# EasyEDA schematic schematic_diagram.json
TITLE: Schemat projektu inżynierskiego; REV: 1.0; Sheet: 1/1; Company: Bartosz Gałczyński
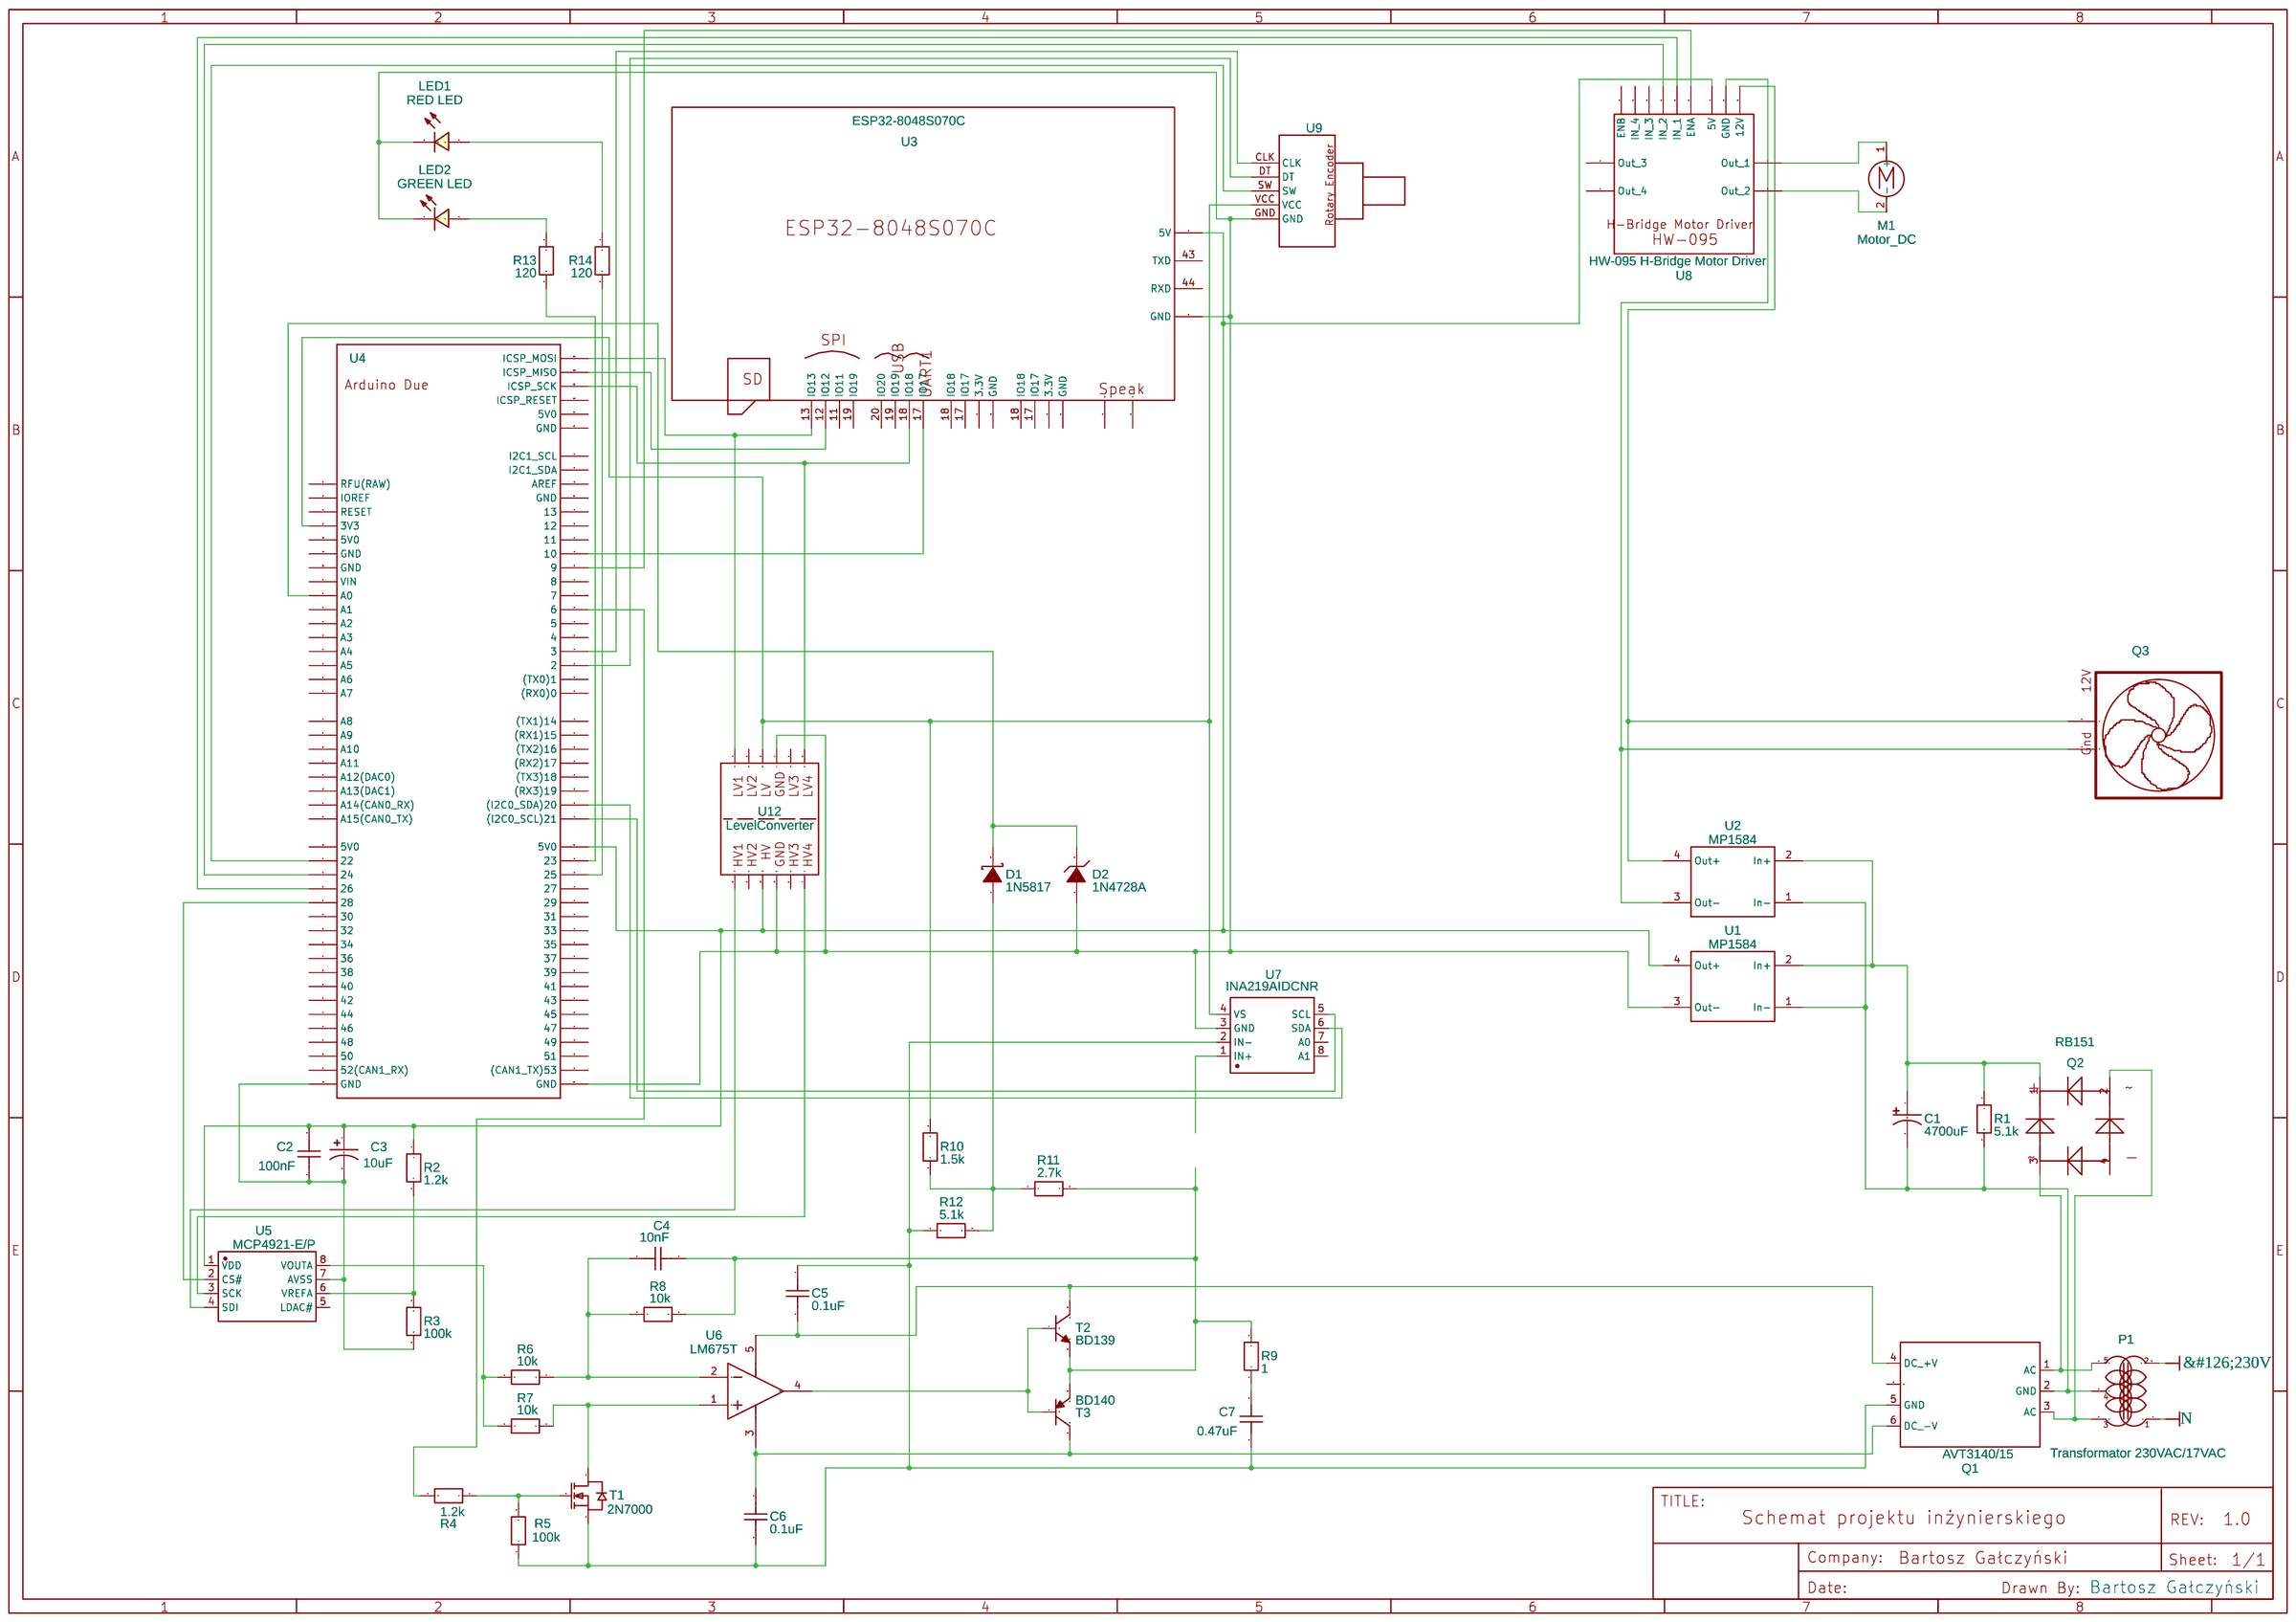
[diagram p0: schematic sheet]

## Parts
C1  4700uF  [CAP-TH_BD10.0-P5.00-D1.0-FD]
C2  100nF  [C0603]
C3  10uF  [CASE-A_3216]
C4  10nF  [C0603]
C5  0.1uF  [C0603]
C6  0.1uF  [C0603]
C7  0.47uF  [C0603]
D1  1N5817  [DO-41_BD2.4-L4.7-P8.70-D0.9-FD]
D2  1N4728A  [DO-41_BD2.4-L4.7-P8.70-D0.9-FD]
LED1  RED LED  [LED-TH_LED-3MM_RED]
LED2  GREEN LED  [LED0603-RD_BLUE]
M1  Motor_DC  [CONN-TH_2P-P5.08]
P1  Transformator 230VAC/17VAC  [TRANS_TOROIDE_40_20]
Q1  AVT3140/15  [POWERPAK-SO-8_L6.2-W5.2-P1.27-BL_POWERPAK]
Q2  RB151  [RB151 THRU RB157]
Q3  NO  [FAN]
R1  5.1k  [R0603]
R2  1.2k  [R0603]
R3  100k  [R0603]
R4  1.2k  [R0603]
R5  100k  [R0603]
R6  10k  [R0603]
R7  10k  [R0603]
R8  10k  [R0603]
R9  1  [R0603]
R10  1.5k  [R0603]
R11  2.7k  [R0603]
R12  5.1k  [R0603]
R13  120  [R0603]
R14  120  [R0603]
T1  2N7000  [TO-92-3_L4.9-W3.7-P1.27-R]
T2  BD139  [TO-126_L7.5-W2.5-P2.3-B]
T3  BD140  [TO-126_L7.5-W2.5-P2.3-B]
U1  MP1584  [MP1584]
U2  MP1584  [MP1584]
U3  ESP32-8048S070C
U4  PA_DUE_BRD  [PA_DUE]
U5  MCP4921-E/P  [PDIP-8_L9.3-W6.4-P2.54-LS7.6-BL]
U6  LM675T  [TO_P5-L10.2-W4.6-P1.70-TR]
U7  INA219AIDCNR  [SOT-23-8_L3.0-W1.7-P0.65-LS2.8-BR]
U8  HW-095 H-Bridge Motor Driver
U9  NO  [ROTARYENCODERF]
U12  LevelConverter  [LEVELCONVERTER_4]

## Library data of the parts
C1 = 50ZLH220MEFC10X16: Contributor: LCSC; Supplier: LCSC; Supplier Part: C424109; Manufacturer: rubycon(红宝石); JLCPCB Part Class: Extended Part; link: https://lcsc.com/eda_search?q=C424109&%26type=1&ref=editor
C2 C4-C7 = C_0603_US: Contributor: LCEDA_Lib
C3 = C_Tan_SMD_A_US: Contributor: LCEDA_Lib
D1 = 1N5817: Supplier: LCSC; Manufacturer: MDD(辰达半导体); Supplier Part: C3062; JLCPCB Part Class: Extended Part; link: https://lcsc.com/eda_search?q=C3062&%26type=1&ref=editor
D2 = 1N4733A: Supplier: LCSC; Manufacturer: TC(德昌); Supplier Part: C112411; JLCPCB Part Class: Extended Part; link: https://lcsc.com/eda_search?q=C112411&%26type=1&ref=editor
LED1 = LED: Supplier: LCSC; Supplier Part: C9900009041; Manufacturer: null; Manufacturer Part: LED05-红灯; Contributor: LCSC; JLCPCB Part Class: Extended Part
LED2 = GREENLED-0603: Contributor: multibytetech; Manufacturer Part: BLUEled-0603; JLCPCB Part Class: Extended Part; Manufacturer: null
M1 = Motor_DC: Contributor: KiCAD; license: https://www.gnu.org/licenses/lgpl-2.1.html
P1 = TRANS_TOROIDE_40_20: Manufacturer Part: Transformers; Contributor: Laercio Oliveira; Supplier: TMZ
Q1 = POWER SUPPLY: Supplier: LCSC; Manufacturer: VISHAY(威世); Manufacturer Part: SI7949DP-T1-GE3; Contributor: michellelema; Supplier Part: C145350; JLCPCB Part Class: Extended Part; Package Display: No
Q2 = SILICON BRIDGE RECTIFIER: link: https://www.mouser.com/ds/2/345/rb151-157-29859.pdf; Contributor: deathstepdspw
Q3 = Fan12V: Contributor: victor390; sim: true
R1-R14 = R_0603_EU: Contributor: LCEDA_Lib
T1 = 2N7000: Supplier: LCSC; Manufacturer: CJ(江苏长电/长晶); Supplier Part: C9114; JLCPCB Part Class: Extended Part
T2 = BD139: Supplier: LCSC; Manufacturer: ST(意法半导体); Supplier Part: C27866; JLCPCB Part Class: Extended Part; link: https://lcsc.com/eda_search?q=C27866&%26type=1&ref=editor
T3 = BD140: Supplier: LCSC; Manufacturer: ST(意法半导体); Supplier Part: C38652; JLCPCB Part Class: Extended Part; link: https://lcsc.com/eda_search?q=C38652&%26type=1&ref=editor
U1 U2 = MP1584: Contributor: ksm_ma
U3 = ESP32-8048S070C: link: https://pl.aliexpress.com/w/wholesale-esp32-8048s070c.html?spm=a2g0o.detail.auto_suggest.2.50cdoOQSoOQSnG; Contributor: gartosz
U4 = PA_DUE_BRD: PatternAgents Due Shield Board Pattern; Contributor: PatternAgents
U5 = MCP4921-E/P: Contributor: lcsc; Supplier: LCSC; Supplier Part: C640392; Manufacturer: MICROCHIP(美国微芯); JLCPCB Part Class: Extended Part; link: https://lcsc.com/eda_search?q=C640392&%26type=1&ref=editor
U6 = LM675T: Contributor: LCSC; Supplier: LCSC; Supplier Part: C1346154; Manufacturer: TI(德州仪器); JLCPCB Part Class: Extended Part; link: https://lcsc.com/eda_search?q=C1346154&%26type=1&ref=editor
U7 = INA219AIDCNR: Supplier: LCSC; Manufacturer: TI(德州仪器); Contributor: LCSC; Supplier Part: C87469; JLCPCB Part Class: Extended Part
U8 = HW-095 H-Bridge Motor Driver: Manufacturer: Lafvin; Manufacturer Part: HW-095; Supplier Part: HW-095; link: https://components101.com/modules/l293n-motor-driver-module; Contributor: ExcaliburStem
U9 = ROTARYENCODER: Contributor: JLHAC
U12 = LevelConverter_4: Contributor: fsergiy

## Nets
&#126;230V: P1.2
N: P1.1
Net-(C1-1): C1.1 Q2.1 R1.1 U1.2(In+) U2.2(In+)
Net-(C1-2): C1.2 P1.4 Q1.2(GND) R1.2 U1.1(In-) U2.1(In-)
Net-(C2-1): C2.1 C3.2 R3.2 U4.GND@2(GND) U5.7(AVSS)
Net-(C2-2): C2.2 C3.1 R2.1 U1.4(Out+) U3.5V U4.5V0@1(5V0) U5.1(VDD) U8.7(5V) U12.10
Net-(C4-1): C4.1 R6.1 R8.2 U6.2(-IN)
Net-(C4-2): C4.2 R8.1 R9.1 R11.2 T2.3(E) T3.3(E)
Net-(C5-1): C5.1 C6.2 C7.1 Q1.5(GND) R5.1 R12.1 T1.1(S) U7.2(IN-)
Net-(C5-2): C5.2 Q1.4(DC +V) T2.2(C) U6.5(VCC)
Net-(C6-1): C6.1 Q1.6(DC -V) T3.2(C) U6.3(VEE)
Net-(C7-2): C7.2 R9.2
Net-(D1-1): D1.1(A) R10.2 R11.1 R12.2
Net-(D1-2): D1.2(K) D2.2(K) U4.A0
Net-(D2-1): D2.1(A) LED1.2 LED2.1(K) U1.3(Out-) U3.GND U4.GND@3(GND) U7.3(GND) U9.GND U12.4 U12.9
Net-(LED1-1): LED1.1 R14.1
Net-(LED2-2): LED2.2(A) R13.2
Net-(M1-1): M1.1(+) U8.1(Out 1)
Net-(M1-2): M1.2(-) U8.2(Out 2)
Net-(P1-3): P1.3 Q1.3(AC) Q2.2
Net-(P1-5): P1.5 Q1.1(AC) Q2.3
Net-(Q3-1): Q3.1 U2.4(Out+) U8.5(12V)
Net-(Q3-2): Q3.2 U2.3(Out-) U8.6(GND)
Net-(R2-2): R2.2 R3.1 U5.6(VREFA)
Net-(R4-1): R4.1 R5.2 T1.2(G)
Net-(R4-2): R4.2 U4.6
Net-(R6-2): R6.2 R7.2 U5.8(VOUTA)
Net-(R7-1): R7.1 T1.3(D) U6.1(+IN)
Net-(R10-1): R10.1 U4.3V3 U7.4(VS) U9.VCC U12.3
Net-(R13-1): R13.1 U4.23
Net-(R14-2): R14.2 U4.25
Net-(T2-1): T2.1(B) T3.1(B) U6.4(OUT)
Net-(U3-12): U3.12(IO12) U4.ICSP_MISO
Net-(U3-13): U3.13(IO13) U4.ICSP_MOSI U12.1
Net-(U3-17): U3.17(IO17) U4.10
Net-(U3-18): U3.18(IO18) U4.ICSP_SCK U12.6
Net-(U4-2): U4.2 U9.DT
Net-(U4-3): U4.3 U9.CLK
Net-(U4-9): U4.9 U8.8(ENA)
Net-(U4-20): U4.20((I2C0_SDA)20) U7.6(SDA)
Net-(U4-21): U4.21((I2C0_SCL)21) U7.5(SCL)
Net-(U4-22): U4.22 U9.SW
Net-(U4-24): U4.24 U8.10(IN 2)
Net-(U4-26): U4.26 U8.9(IN 1)
Net-(U4-28): U4.28 U5.2(CS#)
Net-(U5-3): U5.3(SCK) U12.7
Net-(U5-4): U5.4(SDI) U12.12

Not connected (* = marked no-connect by the designer): Q2 4; U3 3.3V 5(5V) 6(TXD) 11(IO11) 19(IO19) 20(IO20) 43(TXD) 44(RXD); U4 0((RX0)0) 1((TX0)1) 4 5 5V0@0(5V0) 5V0@2(5V0) 5V0@3(5V0) 7 8 11 12 13 14((TX1)14) 15((RX1)15) 16((TX2)16) 17((RX2)17) 18((TX3)18) 19((RX3)19) 27 29 30 31 32 33 34 35 36 37 38 39 40 41 42 43 44 45 46 47 48 49 50 51 52(52(CAN1_RX)) 53((CAN1_TX)53) A1 A2 A3 A4 A5 A6 A7 A8 A9 A10 A11 A12(A12(DAC0)) A13(A13(DAC1)) A14(A14(CAN0_RX)) A15(A15(CAN0_TX)) AREF GND@0(GND) GND@1(GND) GND@4(GND) GND@5(GND) ICSP_RESET IOREF RESET RFU(RFU(RAW)) SCL1(I2C1_SCL) SDA1(I2C1_SDA) VIN; U5 5(LDAC#); U7 1(IN+) 7(A0) 8(A1); U8 3(Out 3) 4(Out 4) 11(IN 3) 12(IN 4) 13(ENB); U12 2 5 8 11

## Notes on the sheet
- Bartosz Gałczyński
